# Altium schematic sheet Project_Overview.SchDoc
size A2; SheetNumber: 1; SheetTotal: 5
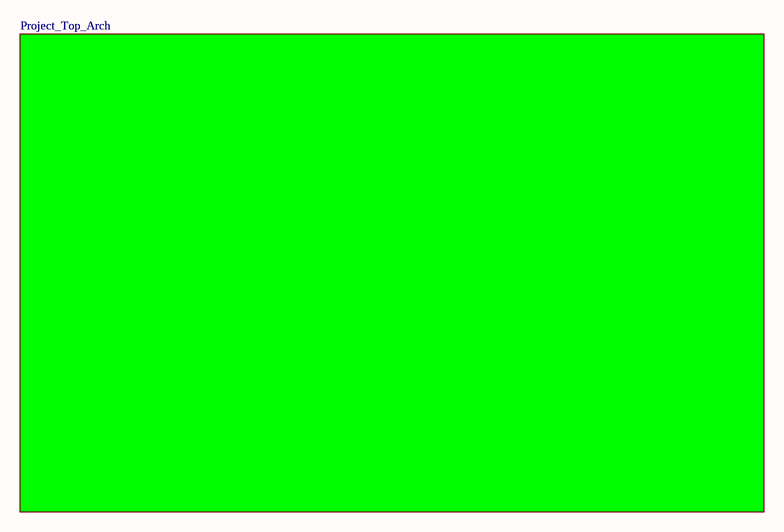
[diagram p0: Project_Overview.SchDoc]

## Sub-sheets
Project_Top_Arch = Project_Top_Arch: no entries